# Altium schematic sheet Astable Clock.schdoc
size 136 x 49 mm
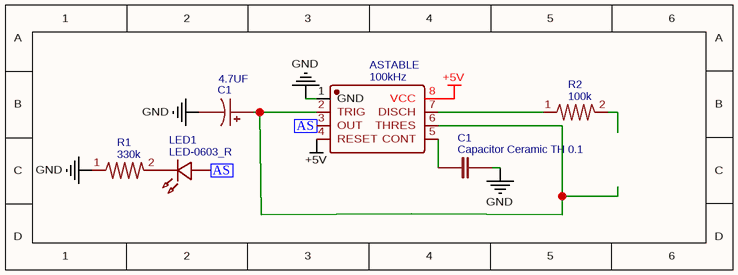
[diagram p0: Astable Clock.schdoc]

## Parts
4.7UF  C1  [ELECTROLYTE CAPACITOR 4.7UF 50V]
ASTABLE  100kHz  [DIP-8_L9.8-W6.6-P2.54-LS7.6-BL]
C1  Capacitor Ceramic TH 0.1  [CAPACITOR CERAMIC TH 0.1]
LED1  LED-0603_R  [LED0603_RED]
R1  330k  [RESISTOR THROUGH-HOLE]
R2  100k  [RESISTOR THROUGH-HOLE]

## Ports
AS (in)

## Nets
+5V: ASTABLE.4(RESET) ASTABLE.8(VCC)
GND: 4.7UF.2 ASTABLE.1(GND) C1.2 R1.1
AS: ASTABLE.3(OUT) LED1.1 ; port AS
Net4.7UF_1: 4.7UF.1 ASTABLE.2(TRIG) ASTABLE.6(THRES)
NetASTABLE_5: ASTABLE.5(CONT) C1.1
NetASTABLE_7: ASTABLE.7(DISCH) R2.1
NetLED1_2: LED1.2 R1.2

Not connected (* = marked no-connect by the designer): R2 2

## Library data of the parts
4.7UF = C1: Contributor: syahindahaqilah97; spicePre: U; spiceSymbolName: Electrolyte Capcitor 4.7uF 50V
ASTABLE = 100kHz: Manufacturer: TI(德州仪器); Manufacturer Part: NE555P; nameAlias: Value; Supplier: LCSC; Supplier Part: C46749; JLCPCB Part Class: Extended Part; spicePre: U; spiceSymbolName: NE555P
C1 = Capacitor Ceramic TH 0.1: Pin Centres: 0.1; Contributor: MelDuckmanton; Component: Capacitor Ceramic TH 0.1; Mounting: TH; Manufacturer Part: ?; spicePre: C; spiceSymbolName: Capacitor Ceramic TH 0.1
LED1 = LED-0603_R: Manufacturer: EVERLIGHT(台湾亿光); Manufacturer Part: 19-217/R6C-AL1M2VY/3T; Contributor: LCEDA_01; Supplier Part: C72044; Supplier: LCSC; spicePre: L; spiceSymbolName: LED-0603_R
R1 = 330k: Contributor: Saepul Hidayat; spicePre: R; spiceSymbolName: res
R2 = 100k: Contributor: Saepul Hidayat; spicePre: R; spiceSymbolName: res